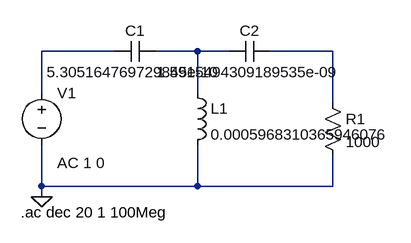
[diagram p0: schematic p3_butter_hpf_4_raw.asc]
p3_butter_hpf_4_raw.asc, the LTspice schematic file:
Version 4
SHEET 1 880 680
WIRE 128 80 16 80
WIRE 256 80 192 80
WIRE 304 80 256 80
WIRE 464 80 368 80
WIRE 16 144 16 80
WIRE 256 144 256 80
WIRE 464 160 464 80
WIRE 16 288 16 224
WIRE 256 288 256 224
WIRE 256 288 16 288
WIRE 464 288 464 240
WIRE 464 288 256 288
WIRE 16 304 16 288
FLAG 16 304 0
SYMBOL voltage 16 128 R0
WINDOW 123 24 124 Left 2
WINDOW 39 0 0 Left 2
SYMATTR Value2 AC 1 0
SYMATTR InstName V1
SYMATTR Value ""
SYMBOL res 448 144 R0
SYMATTR InstName R1
SYMATTR Value 1000
SYMBOL cap 192 64 R90
WINDOW 0 0 32 VBottom 2
WINDOW 3 32 32 VTop 2
SYMATTR InstName C1
SYMATTR Value 5.305164769729845e-10
SYMBOL cap 368 64 R90
WINDOW 0 0 32 VBottom 2
WINDOW 3 32 32 VTop 2
SYMATTR InstName C2
SYMATTR Value 1.5915494309189535e-09
SYMBOL ind 240 128 R0
SYMATTR InstName L1
SYMATTR Value 0.0005968310365946076
TEXT -16 328 Left 2 !.ac dec 20 1 100Meg

The netlist it stands for:
* p3_butter_hpf_4_raw.asc
V1 N001 0 AC 1 0
R1 N003 0 1000
C1 N002 N001 5.305164769729845e-10
C2 N003 N002 1.5915494309189535e-09
L1 N002 0 0.0005968310365946076
.ac dec 20 1 100Meg
.backanno
.end